# Altium project apexvent.PrjPCB
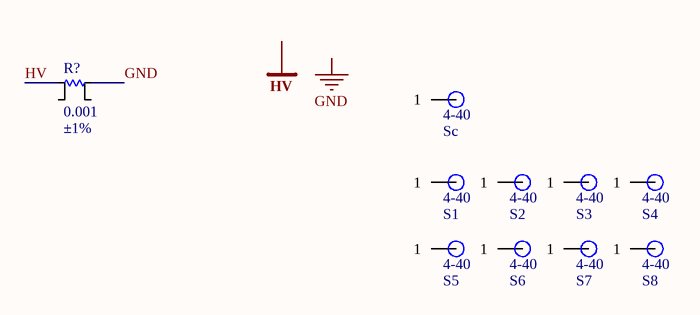
[diagram p0: apexvent.SchDoc]
1 sheet, 10 parts. Net scope: global (net labels, ports and power ports of the same name join across sheets).
Board file: apexvent.PcbDoc

## Sheet apexvent.SchDoc: Sheet Title
size Legal; Organization: Stanford SSI; Address1: L3, 12a Rodborough Rd; Address2: Frenchs Forest; Address3: NSW; Address4: Australia 2086; SheetNumber: n; SheetTotal: m

### Parts
R  Resistance (Ohms): 0.001  Tolerance: ±1%  [R1206_SHUNT]  (hidden comment: RES_0.001_OHM_1W_1%_1206)  (net tie)
S1  4-40 Machine screw  [SCREW_4-40]  (value not drawn)
S2  4-40 Machine screw  [SCREW_4-40]  (value not drawn)
S3  4-40 Machine screw  [SCREW_4-40]  (value not drawn)
S4  4-40 Machine screw  [SCREW_4-40]  (value not drawn)
S5  4-40 Machine screw  [SCREW_4-40]  (value not drawn)
S6  4-40 Machine screw  [SCREW_4-40]  (value not drawn)
S7  4-40 Machine screw  [SCREW_4-40]  (value not drawn)
S8  4-40 Machine screw  [SCREW_4-40]  (value not drawn)
Sc  4-40 Machine screw  [SCREW_4-40]  (value not drawn)

### Nets
GND: R.2
HV: R.1

Not connected (* = marked no-connect by the designer): R 3 4; S1 1; S2 1; S3 1; S4 1; S5 1; S6 1; S7 1; S8 1; Sc 1

### Notes on the sheet
- Labels drawn without touching a wire or pin: GND, HV
- PROJECT
- SHEET
- Powered By
- Sheet
- of
- REVISION
- ssi.stanford.edu
- ENGINEER
- REVIEWER
- REVIEWED ON
- (in symbol SCREW_4-40) 4-40

### Library data of the parts
R = RES_0.001_OHM_1W_1%_1206: RES 0.001 OHM 1W 1% 1206; Manufacturer: Stackpole Electronics Inc; Manufacturer Part Number: CSNL1206FT1L00; Temperature Coefficient: ±50ppm/°C; Supplier 1: Digi-Key; RoHS: RoHS Compliant; Category: Resistors; Stock 1: 28114; Pricing 1: 1=1.05, 10=0.742, 50=0.56, 100=0.49, 250=0.434, 500=0.364, 1000=0.28 (USD); Packaging: Cut Tape (CT); Power (Watts): 1W; Composition: Metal Foil; Features: Current Sense; Package / Case: 1206 (3216 Metric); Supplier Device Package: 1206; Size / Dimension: 0.126" L x 0.063" W (3.20mm x 1.60mm); Height: 0.035" (0.90mm); Number of Terminations: 2; ComponentLink1URL: Datasheet; ComponentLink1Description: http://www.seielect.com/catalog/SEI-CSNL.pdf; Supplier Part Number 1: CSNL1206FT1L00CT-ND
S1-S8 Sc = SCREW_4-40: Supplier 1: Digi-Key